# Altium schematic sheet cs301_Group11.SchDoc
size A4; SheetNumber: 1; SheetTotal: 2; SPICEModelCacheRPIWRWHR: <root> / <DocumentId>RPIWRWHR</DocumentId> / </root>
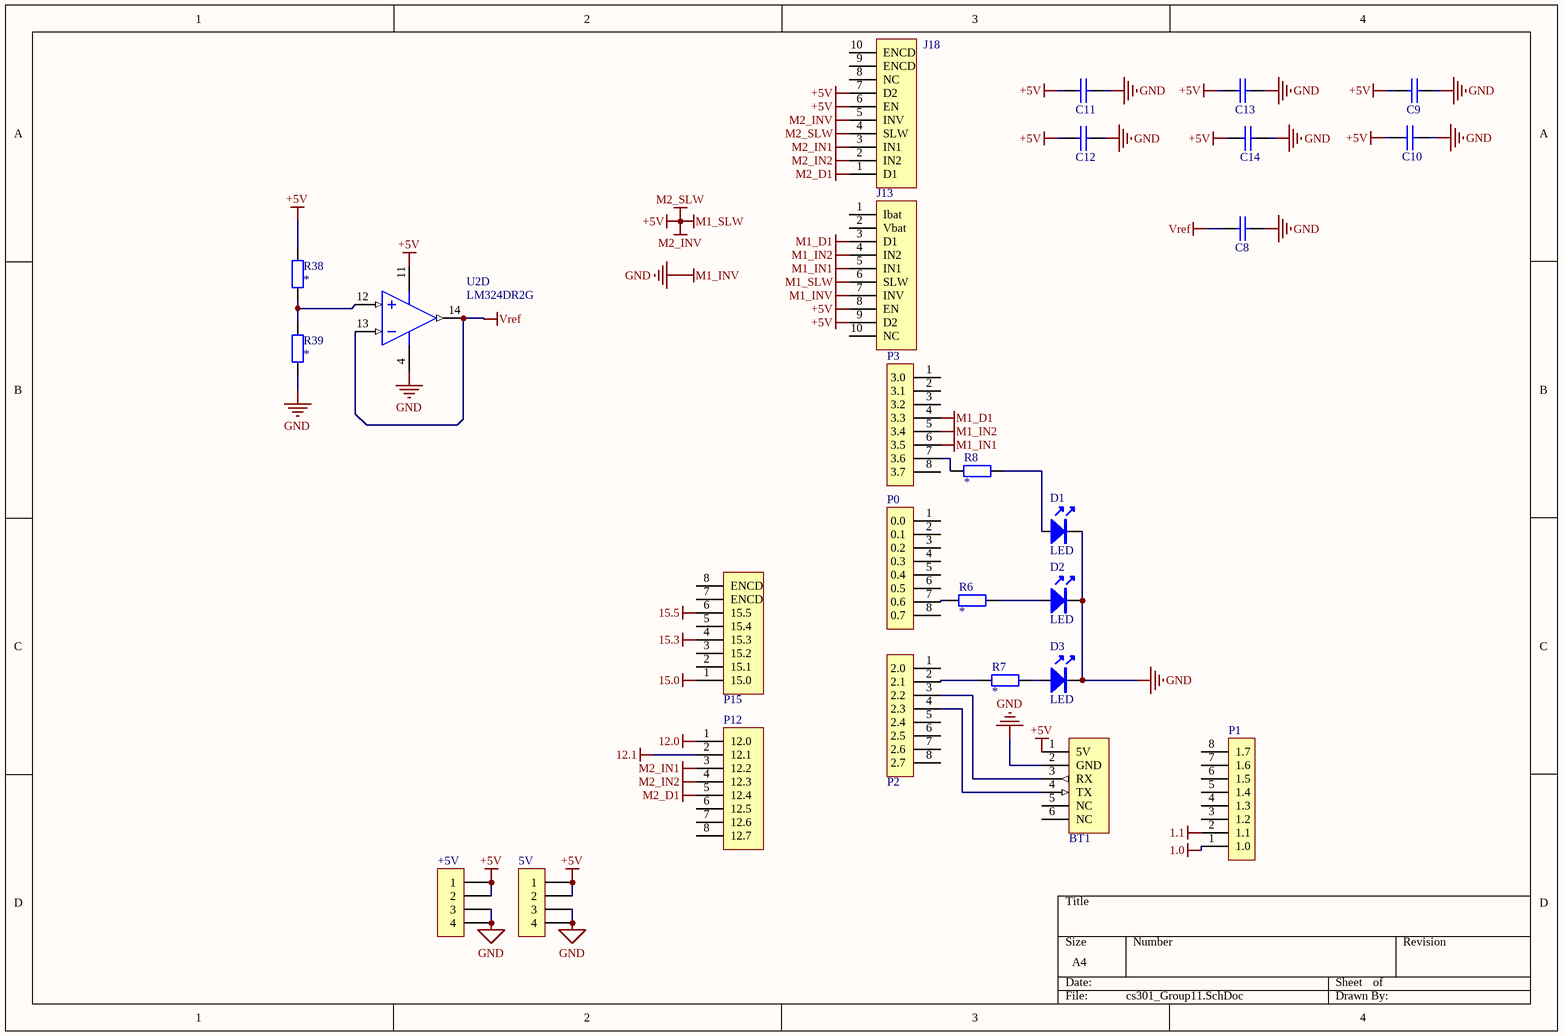
[diagram p0: cs301_Group11.SchDoc]

## Parts
5V  5V  [IDC4]  (value not drawn)
+5V  5V  [IDC4]  (value not drawn)
BT1  BLE Module Header  [HM10_HDR1X6]  (value not drawn)
C8  *  [0805 CAP]  (value not drawn)
C9  *  [0805 CAP]  (value not drawn)
C10  *  [0805 CAP]  (value not drawn)
C11  *  [0805 CAP]  (value not drawn)
C12  *  [0805 CAP]  (value not drawn)
C13  *  [0805 CAP]  (value not drawn)
C14  *  [0805 CAP]  (value not drawn)
D1  LED  [LED0.1/5MM]
D2  LED  [LED0.1/5MM]
D3  LED  [LED0.1/5MM]
J13  CON10  [idc10]  (value not drawn)
J18  CON10  [IDC10]  (value not drawn)
P0  P0  [idc8]  (value not drawn)
P1  P1  [idc8]  (value not drawn)
P2  P2  [idc8]  (value not drawn)
P3  P3  [idc8]  (value not drawn)
P12  P12  [idc8]  (value not drawn)
P15  P15  [idc8]  (value not drawn)
R6  *  [0805 RES]
R7  *  [0805 RES]
R8  *  [0805 RES]
R38  *  [0805 RES]
R39  *  [0805 RES]
U2  LM324DR2G  [SOIC-14]  (part D of 4)

## Nets
1.0: P1.1(1.0)
1.1: P1.2(1.1)
12.0: P12.1(12.0)
12.1: P12.2(12.1)
15.0: P15.1(15.0)
15.3: P15.4(15.3)
15.5: P15.6(15.5)
+5V: 5V.1 5V.2 +5V.1 +5V.2 BT1.1(5V) C9.2 C10.1 C11.1 C12.1 C13.1 C14.1 J13.6(SLW) J13.8(EN) J13.9(D2) J18.4(SLW) J18.5(INV) J18.6(EN) J18.7(D2) R38.2  [also labelled M1_SLW, M2_INV, M2_SLW]
GND: 5V.3 5V.4 +5V.3 +5V.4 BT1.2(GND) C8.2 C9.1 C10.2 C11.2 C12.2 C13.2 C14.2 D1.K D2.K D3.K J13.7(INV) R39.1 U2.4(VCC)  [also labelled M1_INV]
M1_D1: J13.3(D1) P3.4(3.3)
M1_IN1: J13.5(IN1) P3.6(3.5)
M1_IN2: J13.4(IN2) P3.5(3.4)
M2_D1: J18.1(D1) P12.5(12.4)
M2_IN1: J18.3(IN1) P12.3(12.2)
M2_IN2: J18.2(IN2) P12.4(12.3)
Vref: C8.1 U2.13(IN4-) U2.14(OUT4)
NetBT1_3: BT1.3(RX) P2.3(2.2)
NetBT1_4: BT1.4(TX) P2.4(2.3)
NetD1_A: D1.A R8.1
NetD2_A: D2.A R6.2
NetD3_A: D3.A R7.1
NetP0_7: P0.7(0.6) R6.1
NetP2_2: P2.2(2.1) R7.2
NetP3_7: P3.7(3.6) R8.2
NetR38_1: R38.1 R39.2 U2.12(IN4+)

Not connected (* = marked no-connect by the designer): BT1 5(NC) 6(NC); J13 1(Ibat) 2(Vbat) 10(NC); J18 8(NC) 9(ENCD) 10(ENCD); P0 1(0.0) 2(0.1) 3(0.2) 4(0.3) 5(0.4) 6(0.5) 8(0.7); P1 3(1.2) 4(1.3) 5(1.4) 6(1.5) 7(1.6) 8(1.7); P2 1(2.0) 5(2.4) 6(2.5) 7(2.6) 8(2.7); P3 1(3.0) 2(3.1) 3(3.2) 8(3.7); P12 6(12.5) 7(12.6) 8(12.7); P15 2(15.1) 3(15.2) 5(15.4) 7(ENCD) 8(ENCD); U2 11(VEE/GND)

## Notes on the sheet
- Labels drawn without touching a wire or pin: +5V

## Library data of the parts
5V +5V = CON4: Connector
BT1 = BLEModule_TH: 2.54mm pitch 6-pin header for BLE module; LatestRevisionDate: 17-Jul-2002; LatestRevisionNote: Re-released for DXP Platform.; Publisher: Altium Limited
C8-C14 = CerCap_SMT_0805: SMT ceramic capacitor 0805 size; Value: *
J13 J18 = CON10: Connector
P0-P3 = CON8: Connector
P12 P15 = CON8_1: Connector
R6-R8 R38 R39 = Res_SMT_0805: 0805 resistor; Published: 8-Jun-2000; LatestRevisionDate: 17-Jul-2002; LatestRevisionNote: Re-released for DXP Platform.; PackageReference: AXIAL-0.4; Publisher: Altium Limited; Value: *; ComponentLink1Description: https://nz.mouser.com/datasheet/2/315/AOA0000C304-1149620.pdf
U2 = LM324DR_SMT_SOIC16: Single Supply Quad Operational Amplifier, 3 to 32 V, 0 to 70 degC, 14-Pin SOIC, Pb-Free, Tape and Reel; Manufacturer: On Semiconductor; VCC Max (V): 32; VCC Min (V): 3; PackageVersion: Rev. K, 05/2011; ComponentLink3URL: http://www.onsemi.com/pub_link/Collateral/751A-03.PDF; ComponentLink3Description: Package Specification; Packing: Tape and Reel; ComponentLink2URL: http://www.onsemi.cn/pub_link/Collateral/LM324-D.PDF; PackageReference: SOIC-14-751A-03; ComponentLink1URL: http://www.onsemi.com/; PackageDescription: 14-Pin Small Outline Integrated Circuit, Body 8.65 x 3.9 mm, Pitch 1.27 mm; ComponentLink1Description: Manufacturer URL; DatasheetVersion: Rev. 25; Mounting Technology: Surface Mount; RoHS: TRUE; ComponentLink2Description: Datasheet; PartNumber: LM324DR2G